# Altium schematic sheet NANO103.SchDoc
size A3
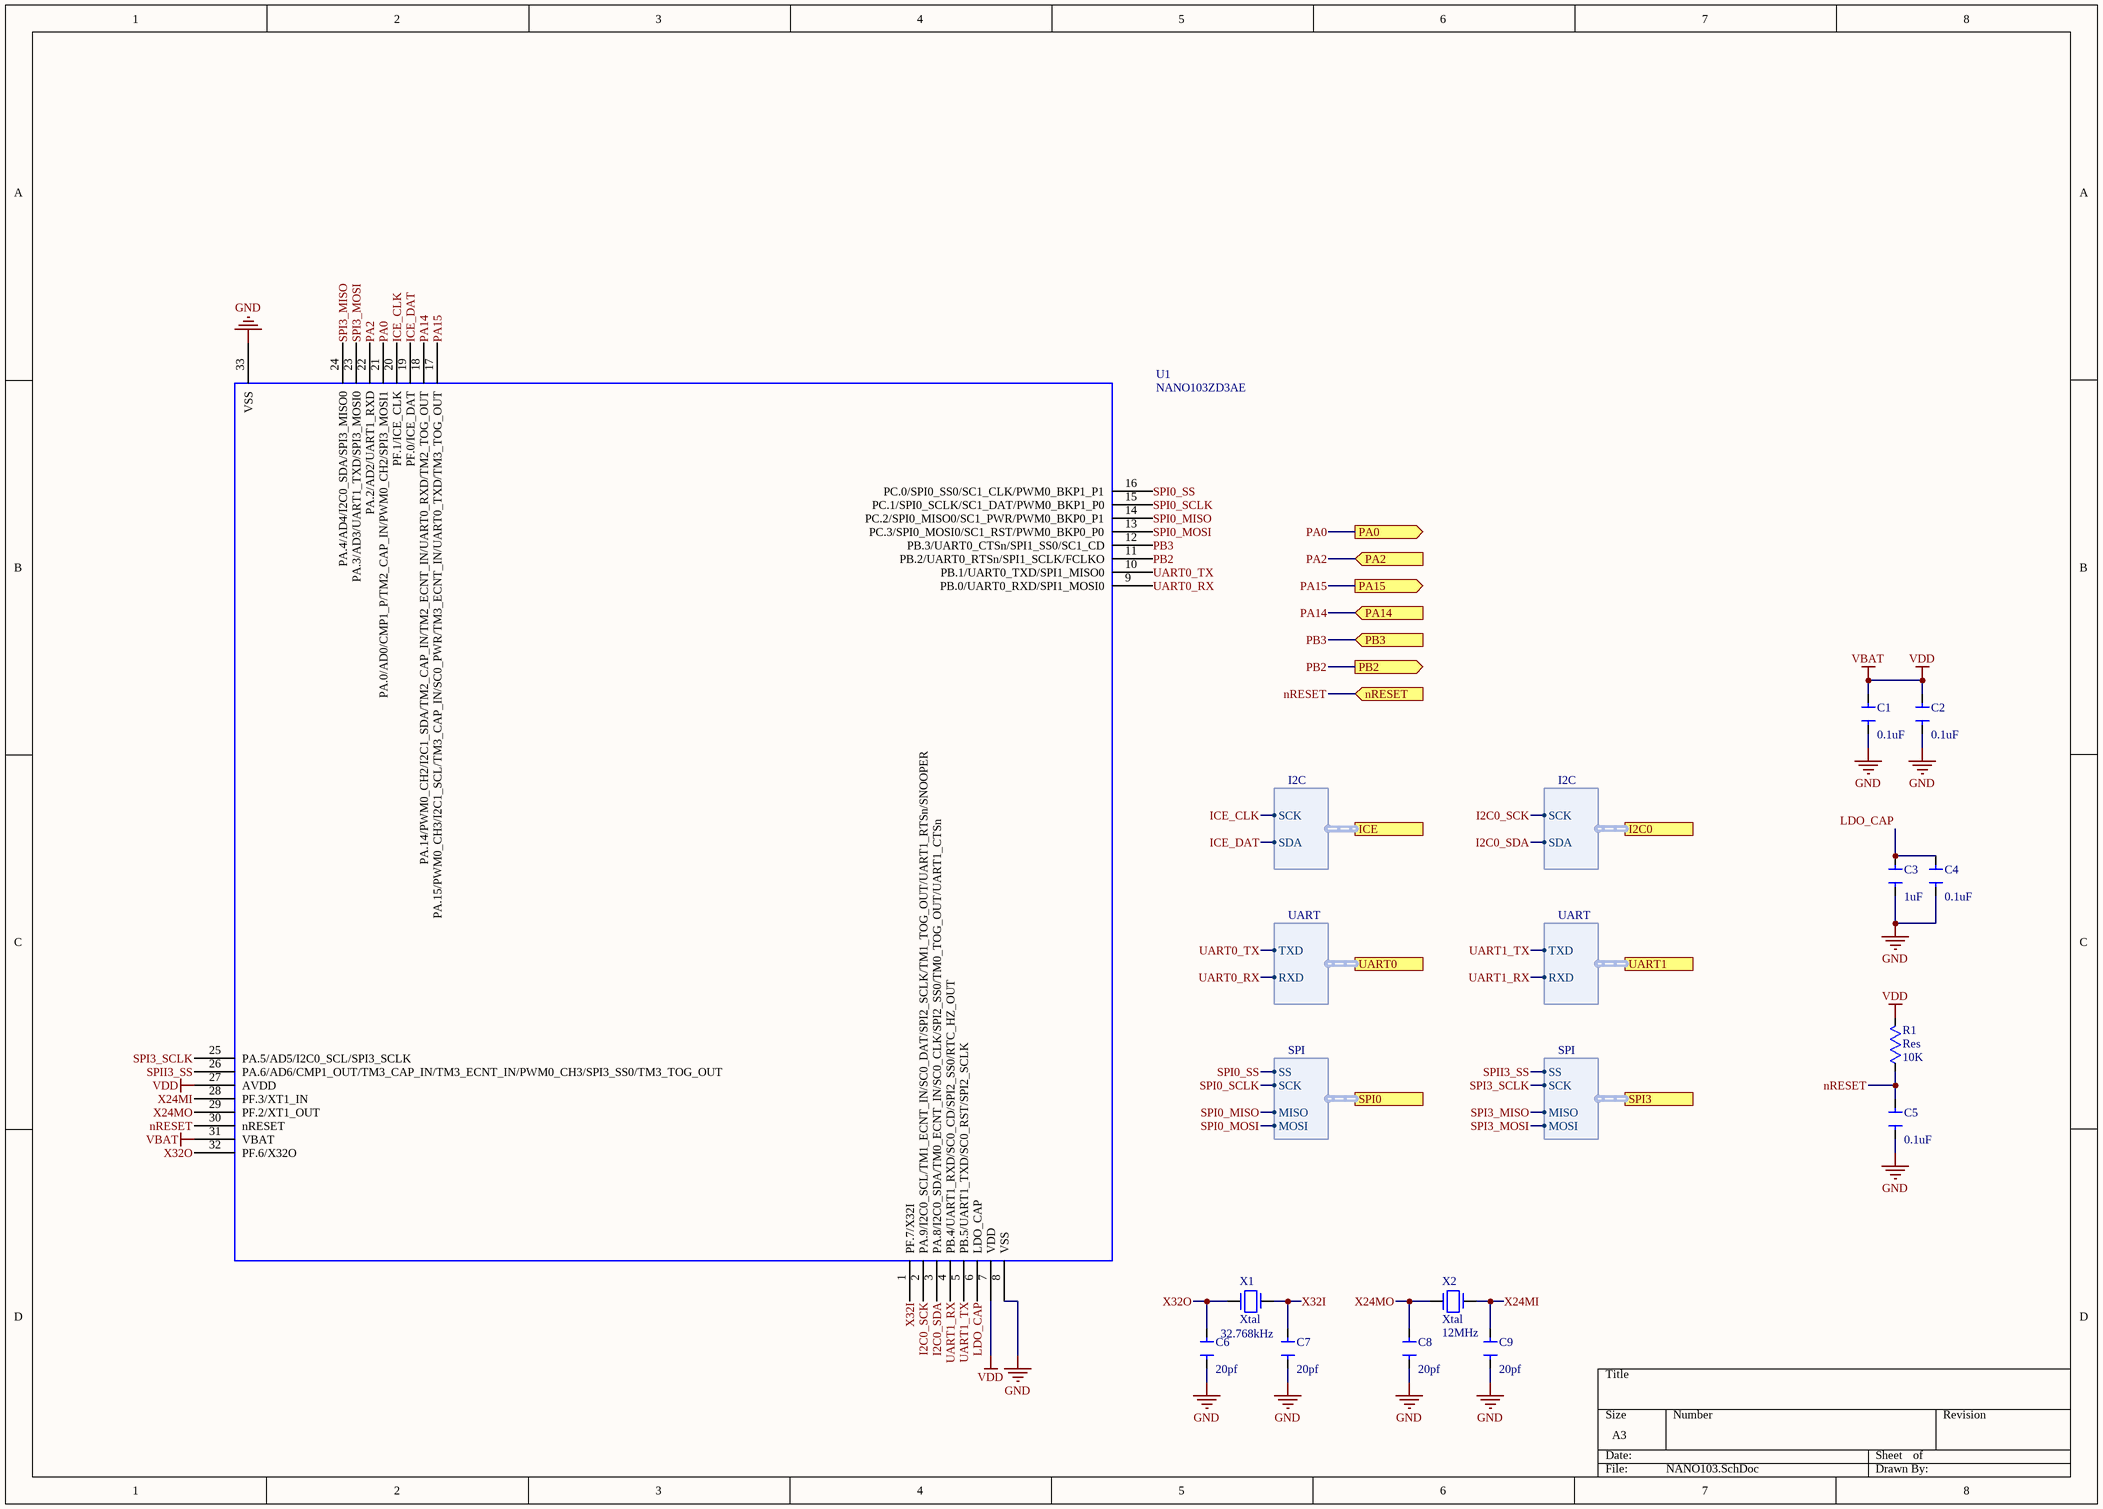
[diagram p0: NANO103.SchDoc]

## Parts
C1  value 0.1uF  [Cap_0603]  (hidden comment: Cap)
C2  value 0.1uF  [Cap_0603]  (hidden comment: Cap)
C3  value 1uF  [Cap_0603]  (hidden comment: Cap)
C4  value 0.1uF  [Cap_0603]  (hidden comment: Cap)
C5  value 0.1uF  [Cap_0603]  (hidden comment: Cap)
C6  value 20pf  [Cap_0603]  (hidden comment: Cap)
C7  value 20pf  [Cap_0603]  (hidden comment: Cap)
C8  value 20pf  [Cap_0603]  (hidden comment: Cap)
C9  value 20pf  [Cap_0603]  (hidden comment: Cap)
R1  Res  value 10K  [RES_0603]
U1  NANO103ZD3AE  [MCU_QFN_33_5x5]
X1  Xtal  value 32.768kHz  [X3215]
X2  Xtal  value 12MHz  [2520S]

## Ports
I2C0 (harness I2C), ICE (harness I2C), nRESET (in), PA0 (out), PA2 (in), PA14 (in), PA15 (out), PB2 (out), PB3 (in), SPI0 (harness SPI), SPI3 (harness SPI), UART0 (harness UART), UART1 (harness UART)

## Harnesses
SPI: SS, SCK, MISO, MOSI
UART: TXD, RXD
I2C: SCK, SDA

## Nets
GND: C1.2 C2.2 C3.2 C4.2 C5.2 C6.2 C7.2 C8.2 C9.2 U1.8(VSS) U1.33(VSS)
VBAT: C1.1 C2.1 R1.1 U1.7(VDD) U1.27(AVDD) U1.31(VBAT)  [also labelled VDD]
I2C0_SCK: U1.2(PA.9/I2C0_SCL/TM1_ECNT_IN/SC0_DAT/SPI2_SCLK/TM1_TOG_OUT/UART1_RTSn/SNOOPER) ; port I2C0.SCK
I2C0_SDA: U1.3(PA.8/I2C0_SDA/TM0_ECNT_IN/SC0_CLK/SPI2_SS0/TM0_TOG_OUT/UART1_CTSn) ; port I2C0.SDA
ICE_CLK: U1.20(PF.1/ICE_CLK) ; port ICE.SCK
ICE_DAT: U1.19(PF.0/ICE_DAT) ; port ICE.SDA
LDO_CAP: C3.1 C4.1 U1.6(LDO_CAP)
nRESET: C5.1 R1.2 U1.30(nRESET) ; port nRESET
PA0: U1.21(PA.0/AD0/CMP1_P/TM2_CAP_IN/PWM0_CH2/SPI3_MOSI1) ; port PA0
PA2: U1.22(PA.2/AD2/UART1_RXD) ; port PA2
PA14: U1.18(PA.14/PWM0_CH2/I2C1_SDA/TM2_CAP_IN/TM2_ECNT_IN/UART0_RXD/TM2_TOG_OUT) ; port PA14
PA15: U1.17(PA.15/PWM0_CH3/I2C1_SCL/TM3_CAP_IN/SC0_PWR/TM3_ECNT_IN/UART0_TXD/TM3_TOG_OUT) ; port PA15
PB2: U1.11(PB.2/UART0_RTSn/SPI1_SCLK/FCLKO) ; port PB2
PB3: U1.12(PB.3/UART0_CTSn/SPI1_SS0/SC1_CD) ; port PB3
SPI0_MISO: U1.14(PC.2/SPI0_MISO0/SC1_PWR/PWM0_BKP0_P1) ; port SPI0.MISO
SPI0_MOSI: U1.13(PC.3/SPI0_MOSI0/SC1_RST/PWM0_BKP0_P0) ; port SPI0.MOSI
SPI0_SCLK: U1.15(PC.1/SPI0_SCLK/SC1_DAT/PWM0_BKP1_P0) ; port SPI0.SCK
SPI0_SS: U1.16(PC.0/SPI0_SS0/SC1_CLK/PWM0_BKP1_P1) ; port SPI0.SS
SPI3_MISO: U1.24(PA.4/AD4/I2C0_SDA/SPI3_MISO0) ; port SPI3.MISO
SPI3_MOSI: U1.23(PA.3/AD3/UART1_TXD/SPI3_MOSI0) ; port SPI3.MOSI
SPI3_SCLK: U1.25(PA.5/AD5/I2C0_SCL/SPI3_SCLK) ; port SPI3.SCK
SPII3_SS: U1.26(PA.6/AD6/CMP1_OUT/TM3_CAP_IN/TM3_ECNT_IN/PWM0_CH3/SPI3_SS0/TM3_TOG_OUT) ; port SPI3.SS
UART0_RX: U1.9(PB.0/UART0_RXD/SPI1_MOSI0) ; port UART0.RXD
UART0_TX: U1.10(PB.1/UART0_TXD/SPI1_MISO0) ; port UART0.TXD
UART1_RX: U1.4(PB.4/UART1_RXD/SC0_CD/SPI2_SS0/RTC_HZ_OUT) ; port UART1.RXD
UART1_TX: U1.5(PB.5/UART1_TXD/SC0_RST/SPI2_SCLK) ; port UART1.TXD
X24MI: C9.1 U1.28(PF.3/XT1_IN) X2.1
X24MO: C8.1 U1.29(PF.2/XT1_OUT) X2.2
X32I: C7.1 U1.1(PF.7/X32I) X1.1
X32O: C6.1 U1.32(PF.6/X32O) X1.2

## Library data of the parts
U1 = NANO103ZD3AE: OriginalSymbolOrigin: (0,0)